# EAGLE schematic cherrymx1 (EAGLE 7.3.0)
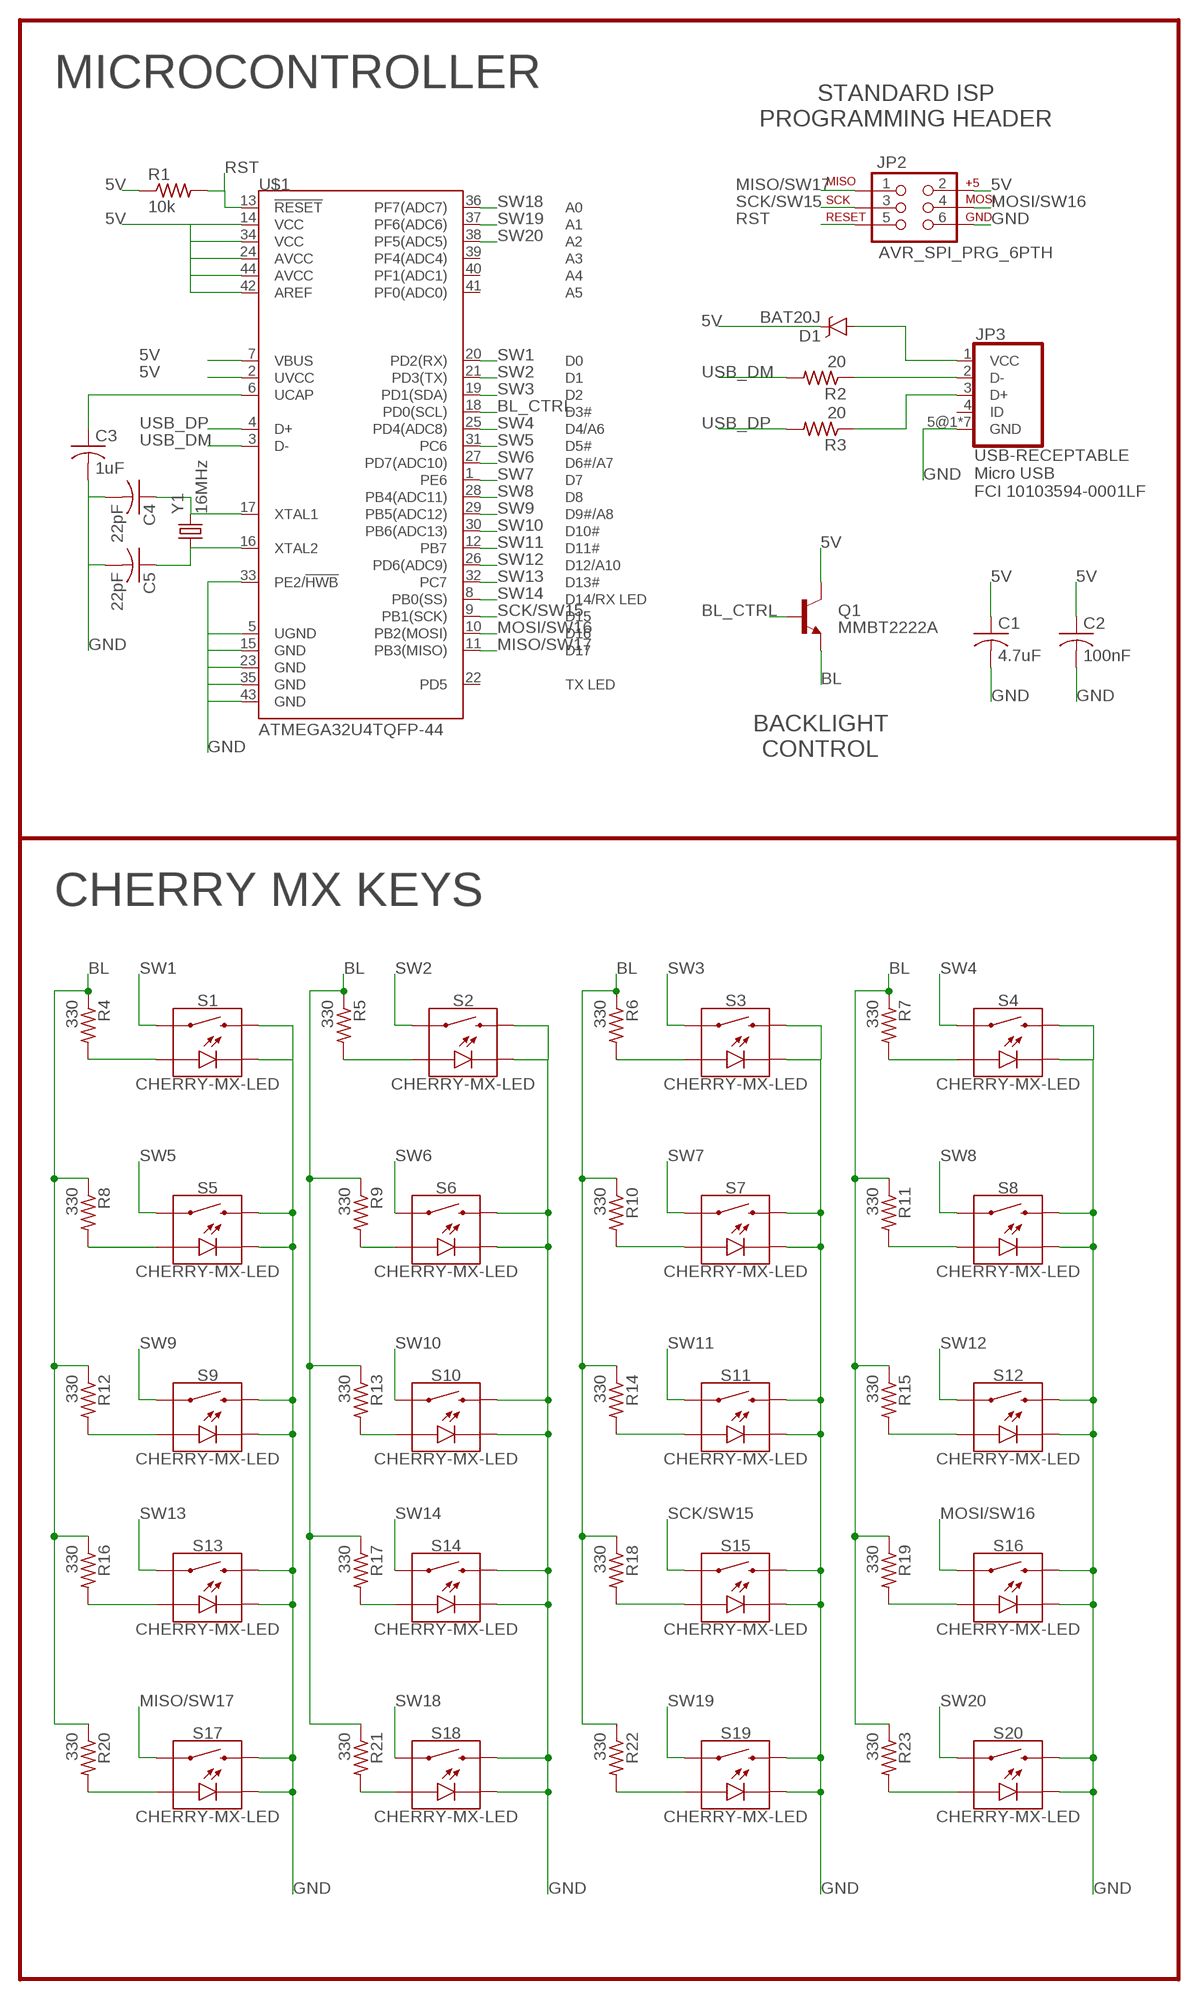
[diagram p0: schematic, sheet 1]

## Parts
C1  4.7uF  C-USC0603  [C0603]
C2  100nF  C-USC0603  [C0603]
C3  1uF  C-USC0603  [C0603]
C4  22pF  C-USC0603  [C0603]
C5  22pF  C-USC0603  [C0603]
D1  BAT20J  DIODE-SCHOTTKY-BAT20J  [SOD-323]
JP2  AVR_SPI_PRG_6PTH  [2X3]
JP3  USB-RECEPTABLE  [FCI-10103594-0001LF]
Q1  MMBT2222A  TRANSISTOR_NPNMMBT2222A  [SOT23-3]
R1  10k  R-US_R0603  [R0603]
R2  20  R-US_R0603  [R0603]
R3  20  R-US_R0603  [R0603]
R4  330  R-US_R0603  [R0603]
R5  330  R-US_R0603  [R0603]
R6  330  R-US_R0603  [R0603]
R7  330  R-US_R0603  [R0603]
R8  330  R-US_R0603  [R0603]
R9  330  R-US_R0603  [R0603]
R10  330  R-US_R0603  [R0603]
R11  330  R-US_R0603  [R0603]
R12  330  R-US_R0603  [R0603]
R13  330  R-US_R0603  [R0603]
R14  330  R-US_R0603  [R0603]
R15  330  R-US_R0603  [R0603]
R16  330  R-US_R0603  [R0603]
R17  330  R-US_R0603  [R0603]
R18  330  R-US_R0603  [R0603]
R19  330  R-US_R0603  [R0603]
R20  330  R-US_R0603  [R0603]
R21  330  R-US_R0603  [R0603]
R22  330  R-US_R0603  [R0603]
R23  330  R-US_R0603  [R0603]
S1  CHERRY-MX-LED  [CHERRY-MX-LED]
S2  CHERRY-MX-LED  [CHERRY-MX-LED]
S3  CHERRY-MX-LED  [CHERRY-MX-LED]
S4  CHERRY-MX-LED  [CHERRY-MX-LED]
S5  CHERRY-MX-LED  [CHERRY-MX-LED]
S6  CHERRY-MX-LED  [CHERRY-MX-LED]
S7  CHERRY-MX-LED  [CHERRY-MX-LED]
S8  CHERRY-MX-LED  [CHERRY-MX-LED]
S9  CHERRY-MX-LED  [CHERRY-MX-LED]
S10  CHERRY-MX-LED  [CHERRY-MX-LED]
S11  CHERRY-MX-LED  [CHERRY-MX-LED]
S12  CHERRY-MX-LED  [CHERRY-MX-LED]
S13  CHERRY-MX-LED  [CHERRY-MX-LED]
S14  CHERRY-MX-LED  [CHERRY-MX-LED]
S15  CHERRY-MX-LED  [CHERRY-MX-LED]
S16  CHERRY-MX-LED  [CHERRY-MX-LED]
S17  CHERRY-MX-LED  [CHERRY-MX-LED]
S18  CHERRY-MX-LED  [CHERRY-MX-LED]
S19  CHERRY-MX-LED  [CHERRY-MX-LED]
S20  CHERRY-MX-LED  [CHERRY-MX-LED]
U$1  ATMEGA32U4TQFP-44  [TQFP44]
Y1  16MHz  CRYSTAL5X3  [CRYSTAL-SMD-5X3]

## Nets
5V: C1.1 C2.1 D1.C JP2.2 Q1.3(C) R1.1 U$1.2(UVCC) U$1.7(VBUS) U$1.14(VCC) U$1.24(AVCC) U$1.34(VCC) U$1.42(AREF) U$1.44(AVCC)
BL: Q1.2(E) R4.1 R5.1 R6.1 R7.1 R8.1 R9.1 R10.1 R11.1 R12.1 R13.1 R14.1 R15.1 R16.1 R17.1 R18.1 R19.1 R20.1 R21.1 R22.1 R23.1
BL_CTRL: Q1.1(B) U$1.18(PD0(SCL))
GND: C1.2 C2.2 C3.2 C4.2 C5.2 JP2.6 JP3.5@1(GND) JP3.5@2(GND) JP3.5@3(GND) JP3.5@4(GND) JP3.5@5(GND) JP3.5@6(GND) JP3.5@7(GND) S1.K(C) S1.S2 S2.K(C) S2.S2 S3.K(C) S3.S2 S4.K(C) S4.S2 S5.K(C) S5.S2 S6.K(C) S6.S2 S7.K(C) S7.S2 S8.K(C) S8.S2 S9.K(C) S9.S2 S10.K(C) S10.S2 S11.K(C) S11.S2 S12.K(C) S12.S2 S13.K(C) S13.S2 S14.K(C) S14.S2 S15.K(C) S15.S2 S16.K(C) S16.S2 S17.K(C) S17.S2 S18.K(C) S18.S2 S19.K(C) S19.S2 S20.K(C) S20.S2 U$1.5(UGND) U$1.15(GND) U$1.23(GND) U$1.33(PE2/!HWB) U$1.35(GND) U$1.43(GND)
MISO/SW17: JP2.1 S17.S1 U$1.11(PB3(MISO))
MOSI/SW16: JP2.4 S16.S1 U$1.10(PB2(MOSI))
N$1: D1.A JP3.1(VCC)
N$2: JP3.2(D-) R2.1
N$3: JP3.3(D+) R3.1
N$4: R8.2 S5.A
N$5: C3.1 U$1.6(UCAP)
N$6: C4.1 U$1.17(XTAL1) Y1.3
N$7: R12.2 S9.A
N$8: C5.1 U$1.16(XTAL2) Y1.1
N$9: R4.2 S1.A
N$10: R6.2 S3.A
N$11: R7.2 S4.A
N$12: R5.2 S2.A
N$13: R16.2 S13.A
N$14: R20.2 S17.A
N$15: R21.2 S18.A
N$16: R17.2 S14.A
N$17: R13.2 S10.A
N$18: R9.2 S6.A
N$19: R22.2 S19.A
N$20: R18.2 S15.A
N$21: R14.2 S11.A
N$22: R10.2 S7.A
N$23: R23.2 S20.A
N$24: R19.2 S16.A
N$25: R15.2 S12.A
N$26: R11.2 S8.A
RST: JP2.5 R1.2 U$1.13(!RESET)
SCK/SW15: JP2.3 S15.S1 U$1.9(PB1(SCK))
SW1: S1.S1 U$1.20(PD2(RX))
SW2: S2.S1 U$1.21(PD3(TX))
SW3: S3.S1 U$1.19(PD1(SDA))
SW4: S4.S1 U$1.25(PD4(ADC8))
SW5: S5.S1 U$1.31(PC6)
SW6: S6.S1 U$1.27(PD7(ADC10))
SW7: S7.S1 U$1.1(PE6)
SW8: S8.S1 U$1.28(PB4(ADC11))
SW9: S9.S1 U$1.29(PB5(ADC12))
SW10: S10.S1 U$1.30(PB6(ADC13))
SW11: S11.S1 U$1.12(PB7)
SW12: S12.S1 U$1.26(PD6(ADC9))
SW13: S13.S1 U$1.32(PC7)
SW14: S14.S1 U$1.8(PB0(SS))
SW18: S18.S1 U$1.36(PF7(ADC7))
SW19: S19.S1 U$1.37(PF6(ADC6))
SW20: S20.S1 U$1.38(PF5(ADC5))
USB_DM: R2.2 U$1.3(D-)
USB_DP: R3.2 U$1.4(D+)
Unconnected: JP3.4(ID) U$1.22(PD5) U$1.39(PF4(ADC4)) U$1.40(PF1(ADC1)) U$1.41(PF0(ADC0))

## Notes on the sheet
- MICROCONTROLLER
- STANDARD ISP
  PROGRAMMING HEADER
- Micro USB
  FCI 10103594-0001LF
- BACKLIGHT
  CONTROL
- CHERRY MX KEYS

## Library data of the parts
C1-C5 = adafruit:C-US: CAPACITOR, American symbol
D1 = SparkFun-DiscreteSemi:DIODE-SCHOTTKY: Schottky diodes in SFE's production catalog BAT20J 1A 23V 0.62Vf RB751 120mA 40V 0.37Vf PMEG4005EJ 0.5A 40V 0.42Vf MBRA140 1A 40V 0.5Vf B340A 3A 40V SMA; PROD_ID: DIO-11623
JP2 = SparkFun-Connectors:AVR_SPI_PRG_6: AVR ISP 6 Pin This is the reduced ISP connector for AVR programming. Common on Arduino. This footprint will take up less PCB space and can be used with a 10-pin to 6-pin adapter such as SKU: BOB-08508 **Special note about "TEST_POINT" package. The stop mask is on the top side, so if you want your programming test points to be on the bottom of your board, make sure to place this package on the bottom side of the board. This also ensure that the orientation to program from the bottom side will be correct.
JP3 = daspilker:USB-RECEPTABLE: USB Receptable
Q1 = SparkFun-DiscreteSemi:TRANSISTOR_NPN: Generic NPN BJT MMBT2222A - TRANS-08049 (SOT-23, 1A 40V) MPSA42 - TRANS-09116 (SOT-23, 500mA 300V) MMBT5088LT1G - TRANS-11160 (SOT-23, 50 mA 30V) BC547 - COM-08928 <http://www.sparkfun.com/products/8928> (TO-92 45V 100mA) (1.Collector 2.Base 3.Emitter) 2N3904 - COM-00521 <http://www.sparkfun.com/products/521> (TO-92 40V 200mA) (1.Emitter 2.Base 3.Collector) P2N2222A - COM-12852 <http://www.sparkfun.com/products/12852> (TO-92 40V 600mA) (1.Collector 2.Base 3.Emitter); PROD_ID: TRANS-08049
R1-R23 = adafruit:R-US_: RESISTOR, American symbol
S1-S20 = SparkFun-Electromechanical2:CHERRY-MX-LED: Cherry MX Switch - Electromechanical Swith w/ LED Cherry MX Keyswitches are top-of-the-line mechanical keyboard switches. They’re satisfyingly “clicky”, reliable up to tens-of-millions of key presses, and a standard in gaming and programming keyboards across the globe. This ‘blue’ version Cherry MX Switch is favored by most due to its secondary internal actuator making it less likely to “double-tap.” If you are looking for a noticeably audible and high-quality key switch, this is the perfect option for you! SparkFun Product Link <https://www.sparkfun.com/products/13834>; SF_ID: COM-13834
U$1 = SparkFun-DigitalIC:ATMEGA32U4: Atmel 44-pin 8-bit Microcontroller with 32KBytes of ISP Flash and USB Controller
Y1 = SparkFun-FreqCtrl:CRYSTAL: Various standard crystals. Proven footprints.; PROD_ID: XTAL-08218